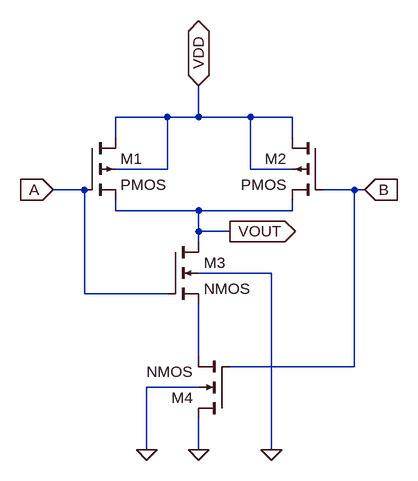
[diagram p0: schematic nand.asc]
nand.asc, the LTspice schematic file:
Version 4
SHEET 1 880 680
WIRE 208 0 128 0
WIRE 256 0 256 -48
WIRE 256 0 208 0
WIRE 336 0 256 0
WIRE 400 0 336 0
WIRE 128 32 128 0
WIRE 400 32 400 0
WIRE 208 80 208 0
WIRE 208 80 128 80
WIRE 336 80 336 0
WIRE 400 80 336 80
WIRE 80 112 32 112
WIRE 496 112 448 112
WIRE 512 112 496 112
WIRE 128 144 128 128
WIRE 256 144 128 144
WIRE 400 144 400 128
WIRE 400 144 256 144
WIRE 256 176 256 144
WIRE 304 176 256 176
WIRE 256 192 256 176
WIRE 368 240 256 240
WIRE 80 272 80 112
WIRE 208 272 80 272
WIRE 256 368 256 288
WIRE 496 384 496 112
WIRE 496 384 304 384
WIRE 256 416 176 416
WIRE 176 512 176 416
WIRE 256 512 256 464
WIRE 368 512 368 240
FLAG 256 512 0
FLAG 32 112 A
IOPIN 32 112 In
FLAG 512 112 B
IOPIN 512 112 In
FLAG 176 512 0
FLAG 256 -48 VDD
IOPIN 256 -48 BiDir
FLAG 368 512 0
FLAG 304 176 VOUT
IOPIN 304 176 Out
SYMBOL pmos4 80 32 R0
SYMATTR InstName M1
SYMATTR Value2 l=5u w=10u
SYMBOL pmos4 448 32 M0
SYMATTR InstName M2
SYMATTR Value2 l=5u w=10u
SYMBOL nmos4 208 192 R0
SYMATTR InstName M3
SYMATTR Value2 l=5u w=20u
SYMBOL nmos4 304 464 R180
SYMATTR InstName M4
SYMATTR Value2 l=5u w=20u

The netlist it stands for:
* nand.asc
M1 VDD A VOUT VDD PMOS l=5u w=10u
M2 VDD B VOUT VDD PMOS l=5u w=10u
M3 VOUT A N001 0 NMOS l=5u w=20u
M4 0 B N001 0 NMOS l=5u w=20u
.model NMOS NMOS
.model PMOS PMOS
.lib standard.mos
.backanno
.end